# EasyEDA schematic Circuito_impresion.json
TITLE: Arreglo para impresión nodo sensor; REV: 2.0; Date: 2022-10-12; Sheet: 1/1; Company: TT A013-2023
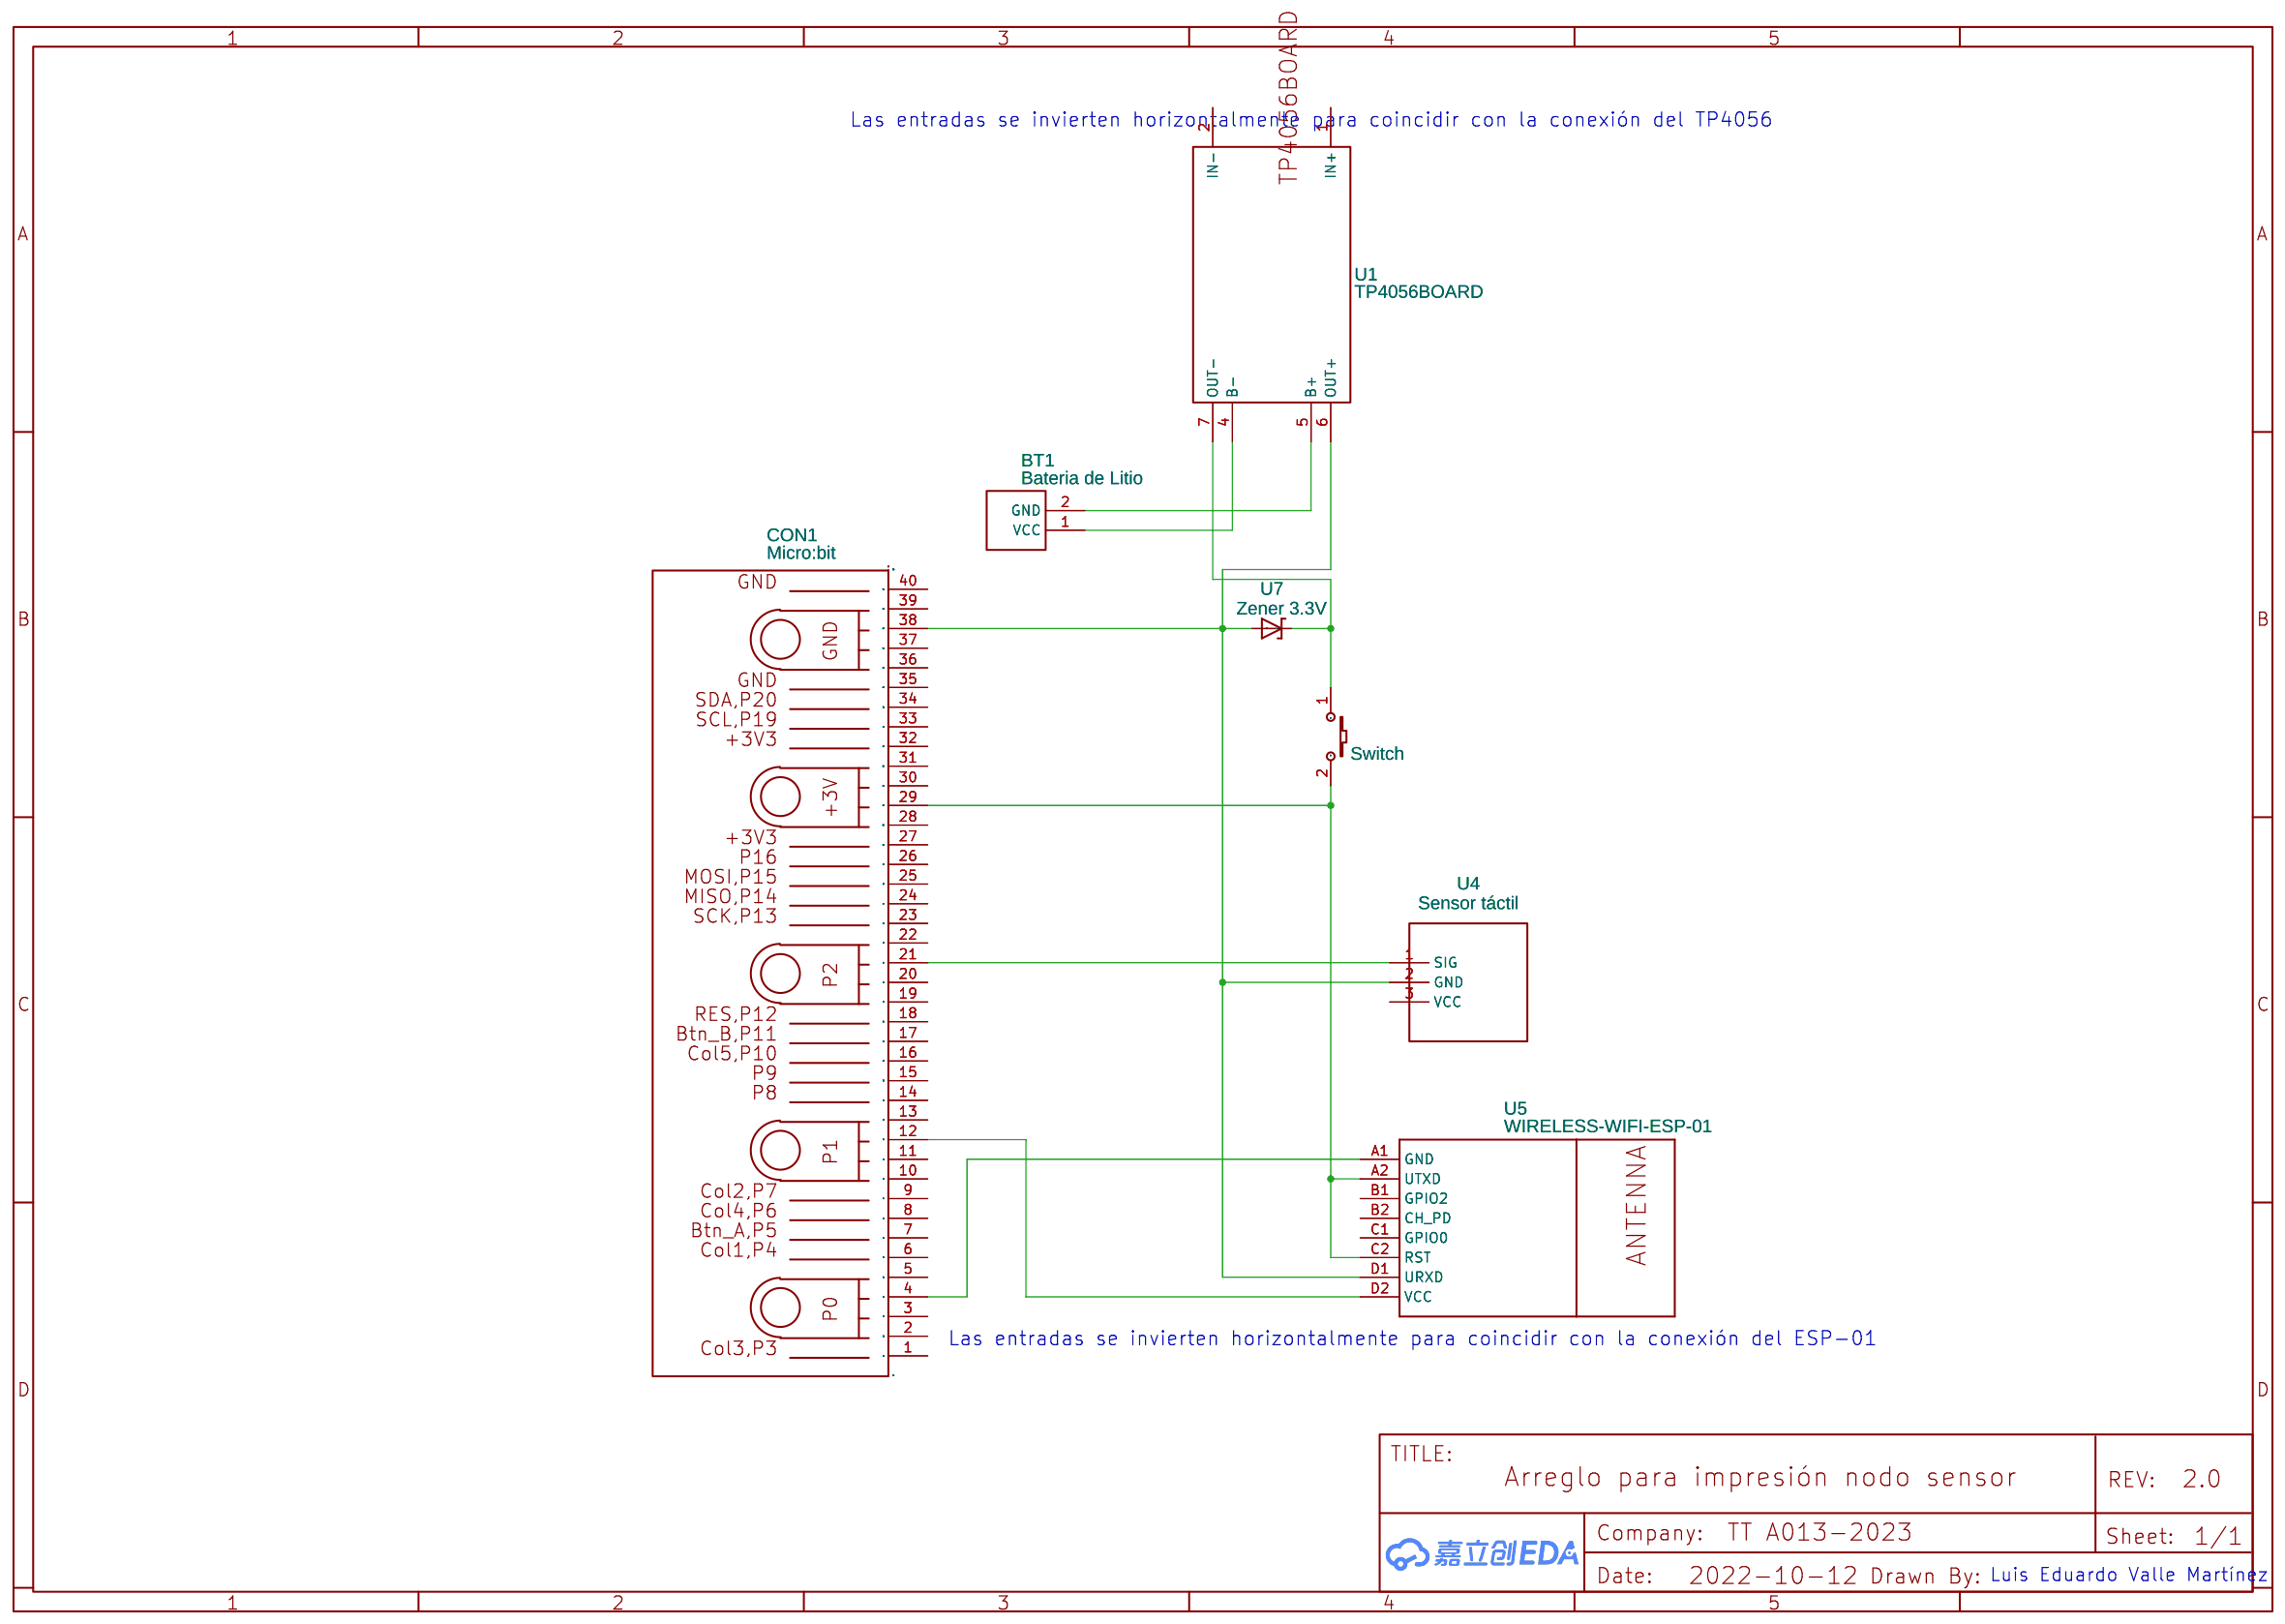
[diagram p0: schematic sheet]

## Parts
BT1  Bateria de Litio  [59MMX33MM]
CON1  Micro:bit  [CYLCONN-MICROBIT-V2-EDGE-40P-180DEG]
KEY1  Switch  [KEY-SMD_2P-L6.2-W3.6-LS8.0]
U1  TP4056BOARD  [TP4056-MICROUSB]
U4  Sensor táctil  [TTP223B CAPACITIVE DIGITAL TOUCH SENSOR TOUCH BUTTON MODULE]
U5  WIRELESS-WIFI-ESP-01  [WIRELESS-WIFI-ESP-01]
U7  Zener 3.3V  [DIODE-ZENER]

## Library data of the parts
BT1 = No.52Section side by side battery box: Supplier: LCSC; Manufacturer: ReliaPro; Supplier Part: C5404; JLCPCB Part Class: Extended Part
CON1 = CYLCONN-MICROBIT-V2-EDGE-40P-180DEG_1
KEY1 = K2-3.6×6.1_SMD: Supplier Part: C118141; Supplier: LCSC; Manufacturer Part: K2-1107ST-A4SW-06; Contributor: LCEDA_Lib; 制造商: 韩国韩荣
U1 = TP4056BOARD: Contributor: joker.0656
U4 = TTP223B Capacitive Digital Touch Sensor Touch Button Module: Contributor: Fabien Valthier
U5 = WIRELESS-WIFI-ESP-01: Wireless Wi-Fi ESP-01 Module based on ESP8266 chip
U7 = DIODE-ZENER: Contributor: SparkFun

## Nets
Net-(BT1-1): BT1.1(VCC) U1.4(B-)
Net-(BT1-2): BT1.2(GND) U1.5(B+)
Net-(CON1-4): CON1.4(P0) U5.A1(GND)
Net-(CON1-12): CON1.12(P1) U5.D2(VCC)
Net-(CON1-21): CON1.21(P2) U4.1(SIG)
Net-(CON1-29): CON1.29(+3V3) KEY1.2 U5.A2(UTXD) U5.C2(RST)
Net-(CON1-38): CON1.38(GND) U1.6(OUT+) U4.2(GND) U5.D1(URXD) U7.P$2(A)
Net-(KEY1-1): KEY1.1 U1.7(OUT-) U7.P$1(C)

Not connected (* = marked no-connect by the designer): CON1 1(P3) 2(P0) 3(P0) 5(P0) 6(P4) 7(P5) 8(P6) 9(P7) 10(P1) 11(P1) 13(P1) 14(P8) 15(P9) 16(P10) 17(P11) 18(P12) 19(P2) 20(P2) 22(P2) 23(P13) 24(P14) 25(P15) 26(P16) 27(+3V3) 28(+3V3) 30(+3V3) 31(+3V3) 32(+3V3) 33(P19) 34(P20) 35(GND) 36(GND) 37(GND) 39(GND) 40(GND) 41(NC41) 42(NC42); U1 1(IN+) 2(IN-); U4 3(VCC); U5 B1(GPIO2) B2(CH_PD) C1(GPIO0)

## Notes on the sheet
- Las entradas se invierten horizontalmente para coincidir con la conexión del TP4056
- Las entradas se invierten horizontalmente para coincidir con la conexión del ESP-01
- Luis Eduardo Valle Martínez
